# EAGLE design CardController (EAGLE 9.2.1)
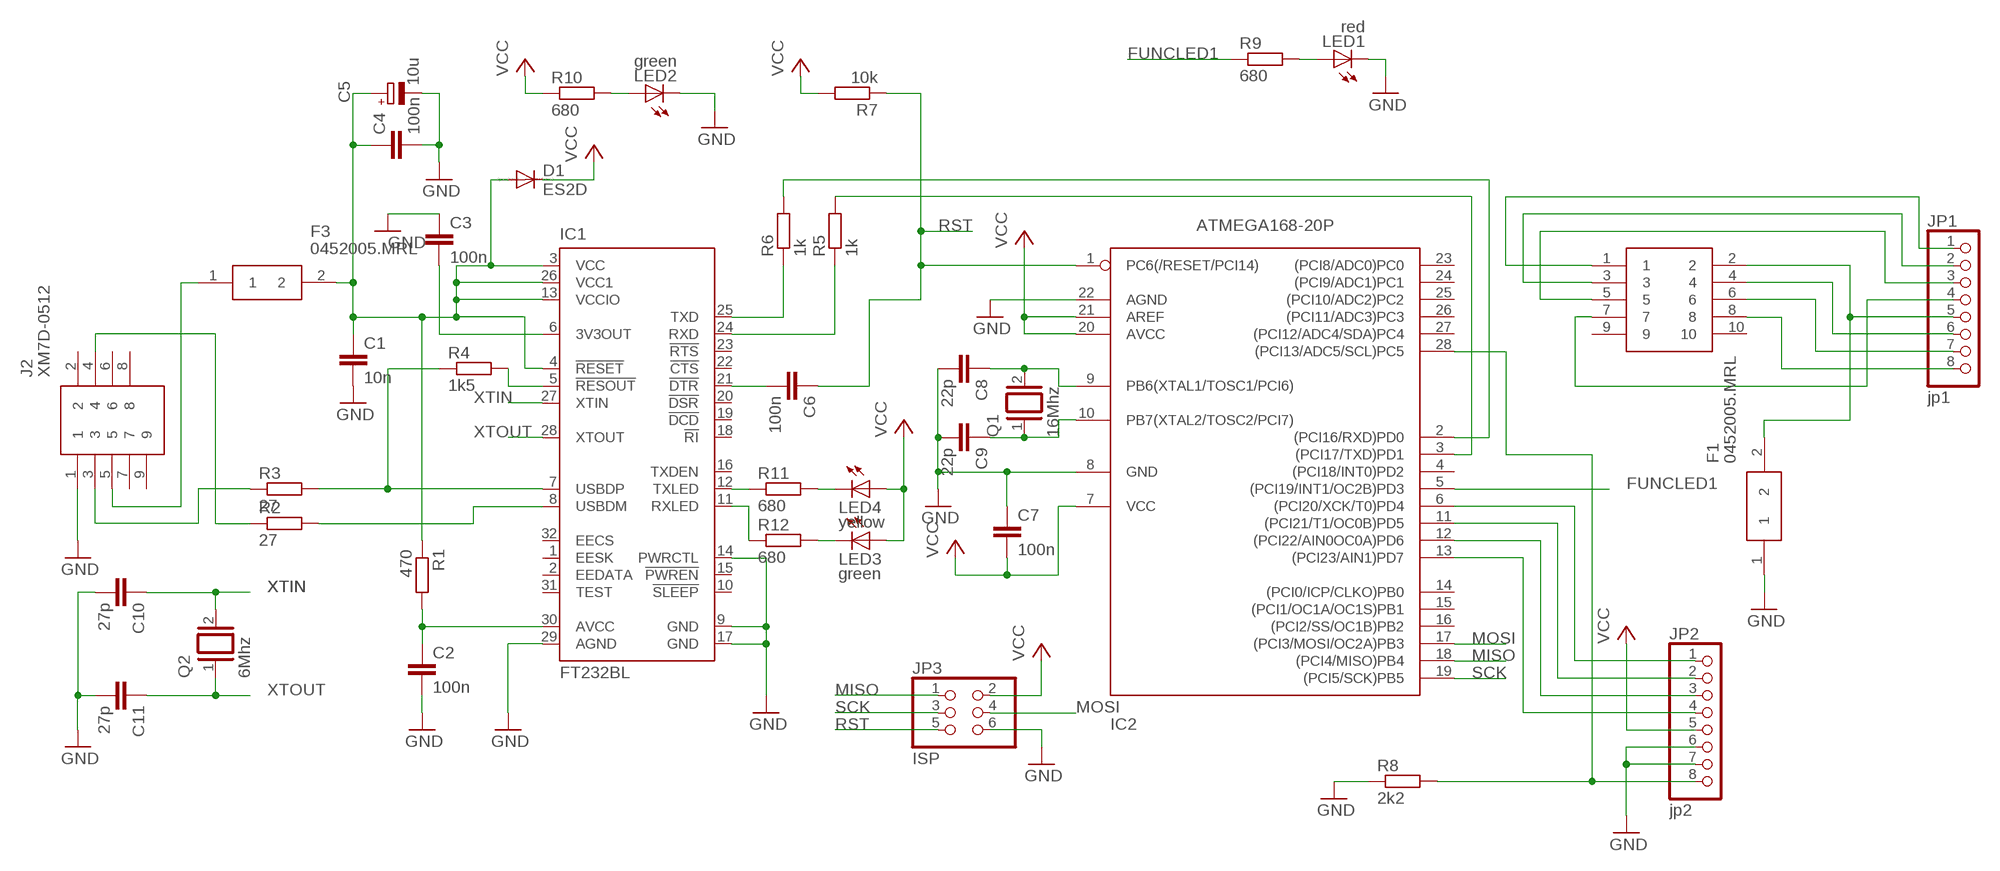
[diagram p0: schematic, sheet 1]

## Parts
C1  10n  C-EUC1206  [C1206]
C2  100n  C-EUC1206  [C1206]
C3  100n  C-EUC1206  [C1206]
C4  100n  C-EUC1206  [C1206]
C5  10u  CPOL-EUB/3528-21W  [B/3528-21W]
C6  100n  C-EUC1206  [C1206]
C7  100n  C-EUC1206  [C1206]
C8  22p  C-EUC1206  [C1206]
C9  22p  C-EUC1206  [C1206]
C10  27p  C-EUC1206  [C1206]
C11  27p  C-EUC1206  [C1206]
D1  ES2D  [SMB]
F1  0452005.MRL  [FUSC6127X294N]
F3  0452005.MRL  [FUSC6127X294N]
IC1  FT232BL  [LQFP32-7X7]
IC2  ATMEGA168-20P  [DIL28-3]
J1  615008140121  [615008140121]
J2  XM7D-0512  [XM7D0512]
JP1  jp1  PINHD-1X8  [1X08]
JP2  jp2  PINHD-1X8  [1X08]
JP3  ISP  PINHD-2X3  [2X03]
LED1  red  LEDSML1206  [SML1206]
LED2  green  LEDSML1206  [SML1206]
LED3  green  LEDSML1206  [SML1206]
LED4  yellow  LEDSML1206  [SML1206]
Q1  16Mhz  XTAL/S  [QS]
Q2  6Mhz  XTAL/S  [QS]
R1  470  R-EU_R0805  [R0805]
R2  27  R-EU_R0805  [R0805]
R3  27  R-EU_R0805  [R0805]
R4  1k5  R-EU_R0805  [R0805]
R5  1k  R-EU_R0805  [R0805]
R6  1k  R-EU_R0805  [R0805]
R7  10k  R-EU_R0805  [R0805]
R8  2k2  R-EU_R0805  [R0805]
R9  680  R-EU_R0805  [R0805]
R10  680  R-EU_R0805  [R0805]
R11  680  R-EU_R0805  [R0805]
R12  680  R-EU_R0805  [R0805]

## Nets
FUNCLED1: IC2.5((PCI19/INT1/OC2B)PD3) R9.1
GND: C1.2 C2.2 C3.1 C4.2 C5.- C7.1 C8.2 C9.2 C10.2 C11.2 F1.1 IC1.9(GND) IC1.14(PWRCTL) IC1.17(GND) IC1.29(AGND) IC2.8(GND) IC2.22(AGND) J2.1 JP2.6 JP2.7 JP3.6 LED1.C LED2.C R8.1
MISO: IC2.18((PCI4/MISO)PB4) JP3.1
MOSI: IC2.17((PCI3/MOSI/OC2A)PB3) JP3.4
N$1: F3.1 J2.5
N$2: C1.1 C4.1 C5.+ D1.A F3.2 IC1.3(VCC) IC1.4(!RESET) IC1.13(VCCIO) IC1.26(VCC1) R1.1
N$3: C2.1 IC1.30(AVCC) R1.2
N$4: C3.2 IC1.6(3V3OUT)
N$5: J2.4 R2.1
N$7: IC1.8(USBDM) R2.2
N$8: J1.3 JP1.2
N$9: IC1.5(!RESOUT) R4.2
N$10: IC1.25(TXD) R6.1
N$11: IC2.2((PCI16/RXD)PD0) R6.2
N$12: IC2.13((PCI23/AIN1)PD7) JP2.4
N$13: IC1.24(RXD) R5.1
N$14: C6.2 IC1.21(!DTR)
N$15: IC2.12((PCI22/AIN0OC0A)PD6) JP2.3
N$16: C8.1 IC2.9(PB6(XTAL1/TOSC1/PCI6)) Q1.2
N$17: C9.1 IC2.10(PB7(XTAL2/TOSC2/PCI7)) Q1.1
N$18: IC2.28((PCI13/ADC5/SCL)PC5) JP2.8 R8.2
N$19: IC1.12(TXLED) R11.1
N$20: LED1.A R9.2
N$21: J1.1 JP1.1
N$22: IC2.3((PCI17/TXD)PD1) R5.2
N$23: IC2.11((PCI21/T1/OC0B)PD5) JP2.2
N$24: IC2.6((PCI20/XCK/T0)PD4) JP2.1
N$25: J1.5 JP1.3
N$26: J1.7 JP1.4
N$27: F1.2 J1.2 JP1.5
N$28: J1.4 JP1.6
N$29: J1.6 JP1.7
N$31: J1.8 JP1.8
N$32: J2.3 R3.1
N$33: LED2.A R10.2
N$34: IC1.11(RXLED) R12.1
N$36: LED4.C R11.2
N$37: LED3.C R12.2
N$40: IC1.7(USBDP) R3.2 R4.1
RST: C6.1 IC2.1(PC6(/RESET/PCI14)) JP3.5 R7.1
SCK: IC2.19((PCI5/SCK)PB5) JP3.3
VCC: C7.2 D1.C IC2.7(VCC) IC2.20(AVCC) IC2.21(AREF) JP2.5 JP3.2 LED3.A LED4.A R7.2 R10.1
XTIN: C10.1 IC1.27(XTIN) Q2.2
XTOUT: C11.1 IC1.28(XTOUT) Q2.1
Unconnected: IC1.1(EESK) IC1.2(EEDATA) IC1.10(!SLEEP) IC1.15(!PWREN) IC1.16(TXDEN) IC1.18(!RI) IC1.19(!DCD) IC1.20(!DSR) IC1.22(!CTS) IC1.23(!RTS) IC1.31(TEST) IC1.32(EECS) IC2.4((PCI18/INT0)PD2) IC2.14((PCI0/ICP/CLKO)PB0) IC2.15((PCI1/OC1A/OC1S)PB1) IC2.16((PCI2/SS/OC1B)PB2) IC2.23((PCI8/ADC0)PC0) IC2.24((PCI9/ADC1)PC1) IC2.25((PCI10/ADC2)PC2) IC2.26((PCI11/ADC3)PC3) IC2.27((PCI12/ADC4/SDA)PC4) J1.9 J1.10 J2.2 J2.6 J2.7 J2.8 J2.9

## Library data of the parts
C1-C4 C6-C11 = rcl:C-EU: CAPACITOR, European symbol; SPICEPREFIX: C
C5 = rcl:CPOL-EU: POLARIZED CAPACITOR, European symbol; SPICEPREFIX: C
D1 = diode:ES2D: DIODE super fast rectifier, 2 A
F1 F3 = SamacSys_Parts:0452005.MRL: Fuse,Nano2,min,452,5A Source: Datasheet <https://componentsearchengine.com/Datasheets/1/0452005.MRL.pdf>; DESCRIPTION: Fuse,Nano2,min,452,5A; HEIGHT: 2.94mm; MANUFACTURER_NAME: LITTELFUSE; MANUFACTURER_PART_NUMBER: 0452005.MRL; MOUSER_PART_NUMBER: 576-0452005.MRL
IC1 = ftdichip:FT232B: USB to serial UART interface Source: DS_FT232BL_BQ.pdf; MF: FARNELL; MPN: FT232BL/TR; OC_FARNELL: unknown; OC_NEWARK: 38K1551
IC2 = adafruit:ATMEGA168*P: MICROCONTROLLER 16 kBytes FLASH 1 kBytes SRAM 512 Bytes EEPROM USART 8-channel 10 bit ADC
J1 = SamacSys_Parts:615008140121: Wurth Elektronik WR-MJ, 615008 Series Series Number Cat5 8 Way Horizontal PCB Mount STP RJ45 Modular Jack, Socket Source: Datasheet <https://componentsearchengine.com/Datasheets/1/615008140121.pdf>; DESCRIPTION: Wurth Elektronik WR-MJ, 615008 Series Series Number Cat5 8 Way Horizontal PCB Mount STP RJ45 Modular Jack, Socket; HEIGHT: 12mm; MANUFACTURER_NAME: Wurth Elektronik; MANUFACTURER_PART_NUMBER: 615008140121; MOUSER_PART_NUMBER: 710-615008140121
J2 = SamacSys_Parts:XM7D-0512: OMRON ELECTRONIC COMPONENTS - XM7D-0512 - MINI USB, 2.0 TYPE B, RECEPTACLE, TH Source: Datasheet <https://componentsearchengine.com/Datasheets/1/XM7D-0512.pdf>; DESCRIPTION: OMRON ELECTRONIC COMPONENTS - XM7D-0512 - MINI USB, 2.0 TYPE B, RECEPTACLE, TH; HEIGHT: 3mm; MANUFACTURER_NAME: Omron Electronics; MANUFACTURER_PART_NUMBER: XM7D-0512; MOUSER_PART_NUMBER: 653-XM7D-0512
JP1 JP2 = pinhead:PINHD-1X8: PIN HEADER
JP3 = pinhead:PINHD-2X3: PIN HEADER
LED1-LED4 = led:LED: LED OSRAM: - CHIPLED LG R971, LG N971, LY N971, LG Q971, LY Q971, LO R971, LY R971 LH N974, LH R974 LS Q976, LO Q976, LY Q976 LO Q996 - Hyper CHIPLED LW Q18S LB Q993, LB Q99A, LB R99A - SideLED LS A670, LO A670, LY A670, LG A670, LP A670 LB A673, LV A673, LT A673, LW A673 LH A674 LY A675 LS A676, LA A676, LO A676, LY A676, LW A676 LS A679, LY A679, LG A679 - Hyper Micro SIDELED® LS Y876, LA Y876, LO Y876, LY Y876 LT Y87S - SmartLED LW L88C, LW L88S LB L89C, LB L89S, LG L890 LS L89K, LO L89K, LY L89K LS L896, LA L896, LO L896, LY L896 - TOPLED LS T670, LO T670, LY T670, LG T670, LP T670 LSG T670, LSP T670, LSY T670, LOP T670, LYG T670 LG T671, LOG T671, LSG T671 LB T673, LV T673, LT T673, LW T673 LH T674 LS T676, LA T676, LO T676, LY T676, LB T676, LH T676, LSB T676, LW T676 LB T67C, LV T67C, LT T67C, LS T67K, LO T67K, LY T67K, LW E67C LS E67B, LA E67B, LO E67B, LY E67B, LB E67C, LV E67C, LT E67C LW T67C LS T679, LY T679, LG T679 LS T770, LO T770, LY T770, LG T770, LP T770 LB T773, LV T773, LT T773, LW T773 LH T774 LS E675, LA E675, LY E675, LS T675 LS T776, LA T776, LO T776, LY T776, LB T776 LHGB T686 LT T68C, LB T68C - Hyper Mini TOPLED® LB M676 - Mini TOPLED Santana® LG M470 LS M47K, LO M47K, LY M47K Source: http://www.osram.convergy.de LUXEON: - LUMILED® LXK2-PW12-R00, LXK2-PW12-S00, LXK2-PW14-U00, LXK2-PW14-V00 LXK2-PM12-R00, LXK2-PM12-S00, LXK2-PM14-U00 LXK2-PE12-Q00, LXK2-PE12-R00, LXK2-PE12-S00, LXK2-PE14-T00, LXK2-PE14-U00 LXK2-PB12-K00, LXK2-PB12-L00, LXK2-PB12-M00, LXK2-PB14-N00, LXK2-PB14-P00, LXK2-PB14-Q00 LXK2-PR12-L00, LXK2-PR12-M00, LXK2-PR14-Q00, LXK2-PR14-R00 LXK2-PD12-Q00, LXK2-PD12-R00, LXK2-PD12-S00 LXK2-PH12-R00, LXK2-PH12-S00 LXK2-PL12-P00, LXK2-PL12-Q00, LXK2-PL12-R00 Source: www.luxeon.com KINGBRIGHT: KA-3528ASYC Source: www.kingbright.com
Q1 Q2 = special:XTAL/S: CRYSTAL
R1-R12 = rcl:R-EU_: RESISTOR, European symbol; SPICEPREFIX: R

## Board
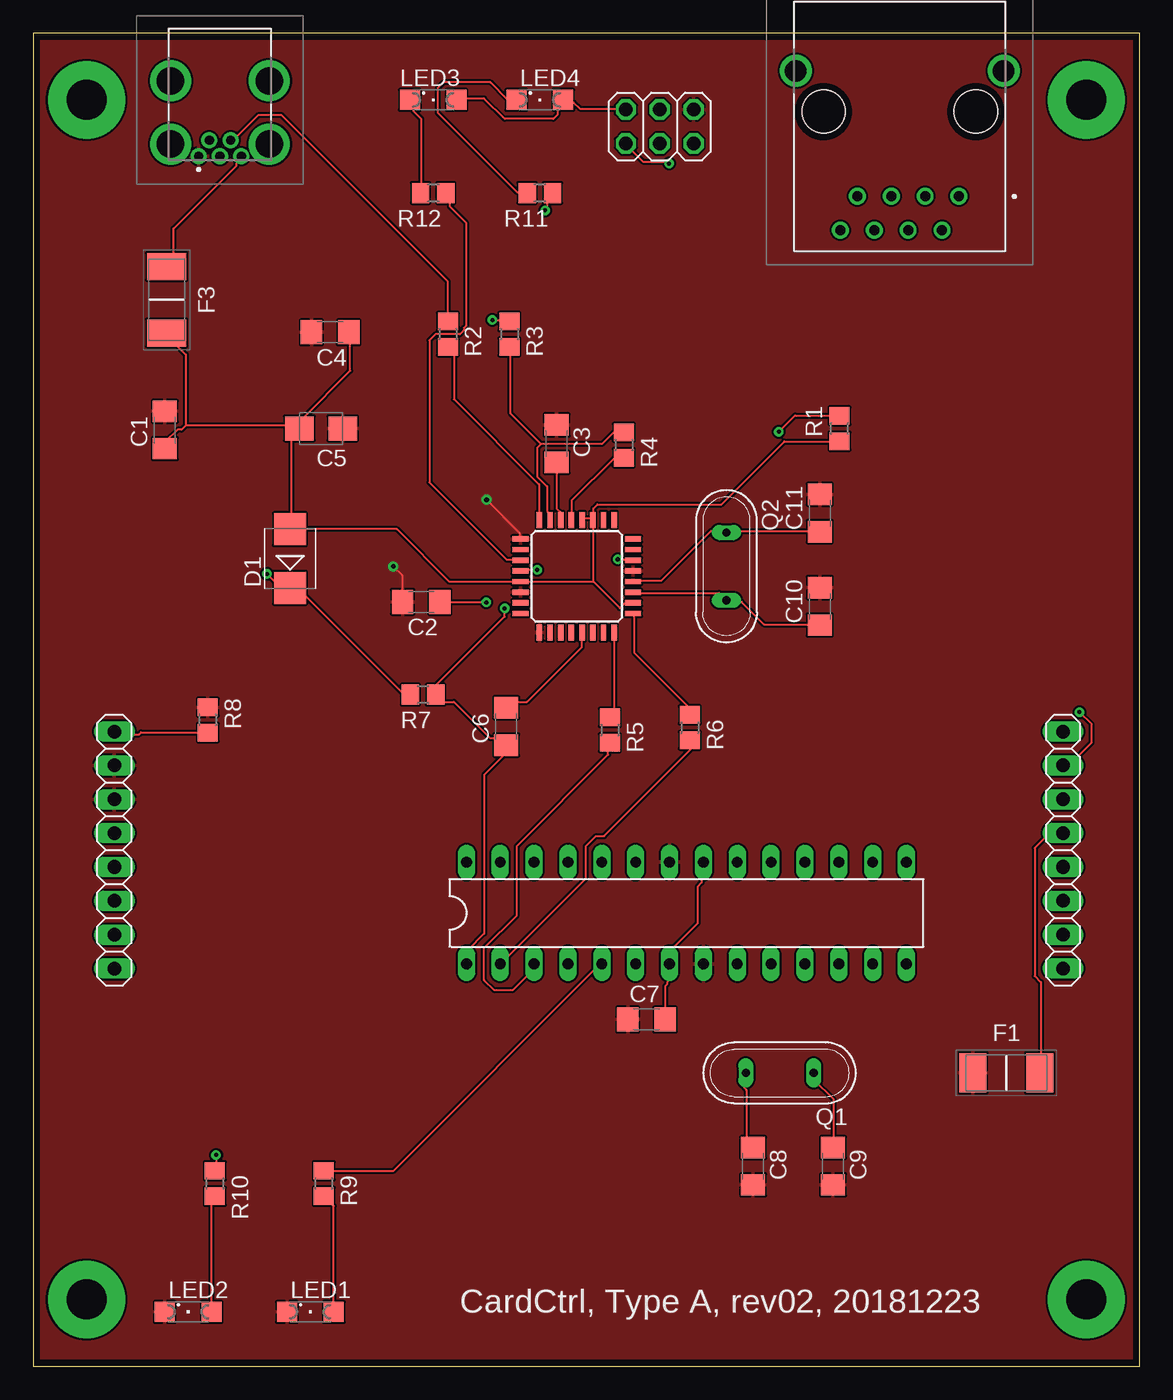
[diagram p1: board, top side]
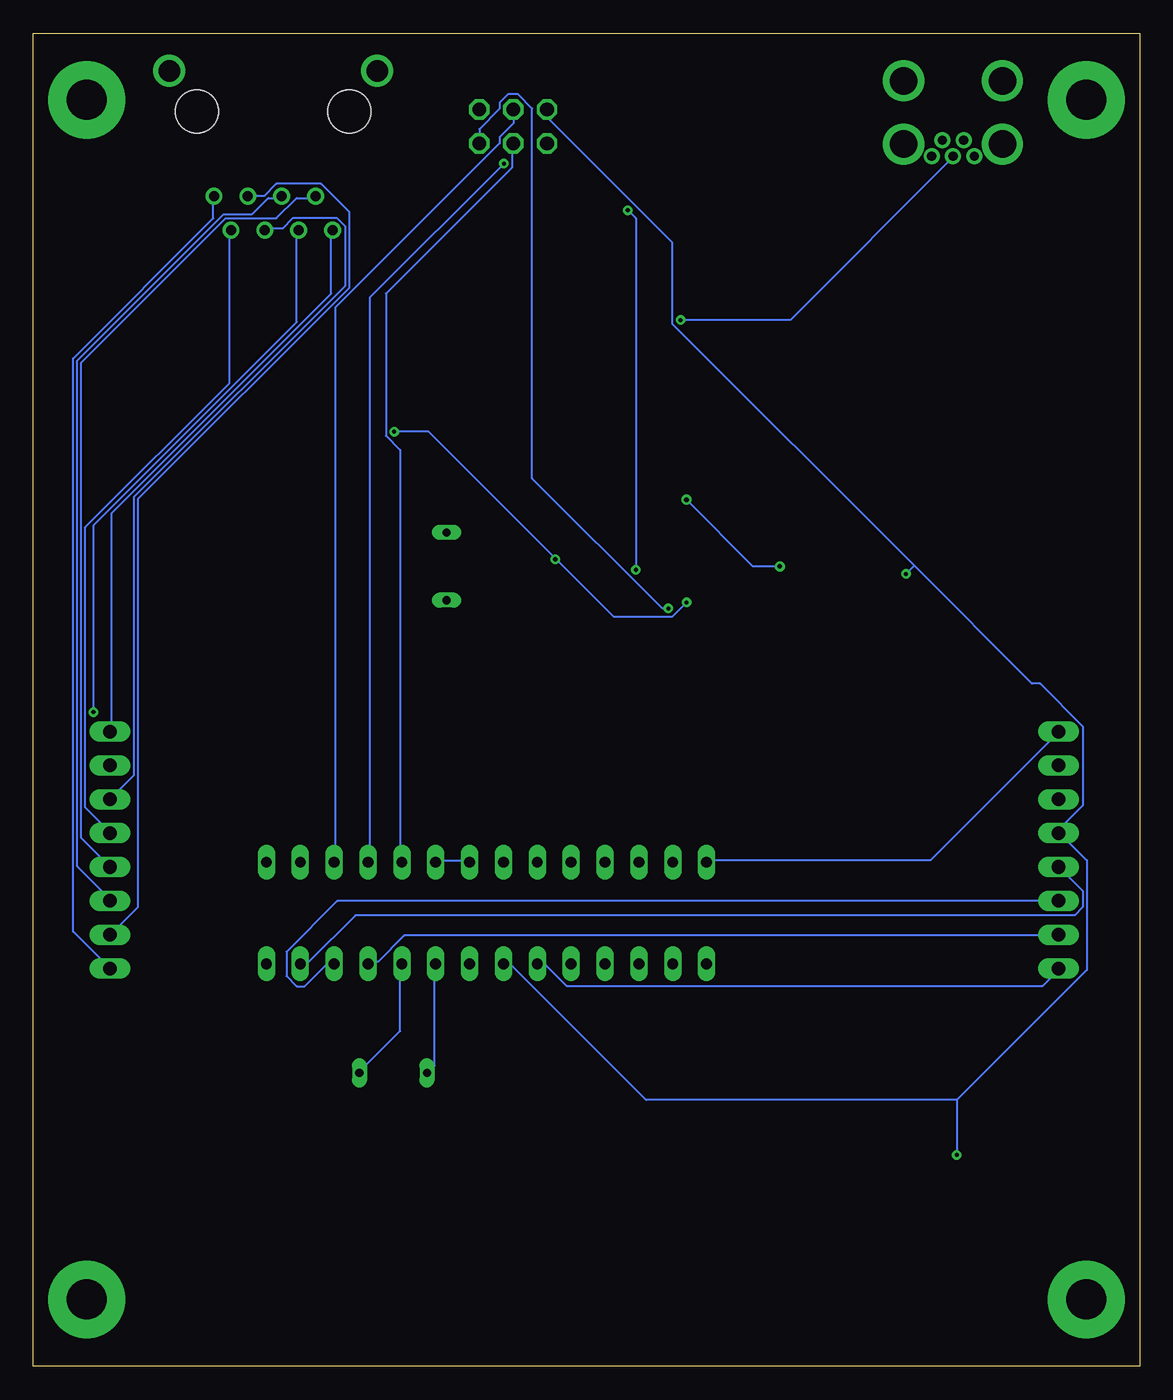
[diagram p2: board, bottom side, seen from below]

Size 83 x 99.99 mm. Coordinates in mm from the lower left corner, seen from the top.
Outline: 0,0 83,0 83,99.99 0,99.99 0,0
Copper layers (1*16): Top 0.035mm / dielectric 1.5mm / Bottom 0.035mm
Design rules "NYAKARUHAZ_StandardNYAK": minimum track width 6mil, minimum drill 12mil, track to track 6mil, track to pad 6mil, pad to pad 6mil, via to via 6mil, smd to smd 6mil, copper to edge 20mil, drill to drill 8mil, minimum pad ring 10mil, minimum via ring 8mil, stop-mask expansion 4mil, vias tented up to drill 0mil, thermal gap 6mil

### Footprints (pad centres in the part's own frame; a part is rotated, then mirrored left to right if it is on the bottom)
C1206 = smd 1.6 x 1.8: 1 -1.4,0; 2 1.4,0
B/3528-21W = smd 2.15 x 1.8: + 1.625,0; - -1.625,0
SMB = smd 2.4 x 2.4: A 2.2,0; C -2.2,0
FUSC6127X294N = smd 2.02 x 2.95: 1 -2.5,0; 2 2.5,0
LQFP32-7X7 = smd 1.2 x 0.4: 1 -4.225,2.8; 2 -4.225,2; 3 -4.225,1.2; 4 -4.225,0.4; 5 -4.225,-0.4; 6 -4.225,-1.2; 7 -4.225,-2; 8 -4.225,-2.8; 17 4.225,-2.8; 18 4.225,-2; 19 4.225,-1.2; 20 4.225,-0.4; 21 4.225,0.4; 22 4.225,1.2; 23 4.225,2; 24 4.225,2.8 | smd 0.4 x 1.2: 9 -2.8,-4.225; 10 -2,-4.225; 11 -1.2,-4.225; 12 -0.4,-4.225; 13 0.4,-4.225; 14 1.2,-4.225; 15 2,-4.225; 16 2.8,-4.225; 25 2.8,4.225; 26 2,4.225; 27 1.2,4.225; 28 0.4,4.225; 29 -0.4,4.225; 30 -1.2,4.225; 31 -2,4.225; 32 -2.8,4.225
DIL28-3 = drill 0.813 long: 1 -16.51,-3.81; 2 -13.97,-3.81; 3 -11.43,-3.81; 4 -8.89,-3.81; 5 -6.35,-3.81; 6 -3.81,-3.81; 7 -1.27,-3.81; 8 1.27,-3.81; 9 3.81,-3.81; 10 6.35,-3.81; 11 8.89,-3.81; 12 11.43,-3.81; 13 13.97,-3.81; 14 16.51,-3.81; 15 16.51,3.81; 16 13.97,3.81; 17 11.43,3.81; 18 8.89,3.81; 19 6.35,3.81; 20 3.81,3.81; 21 1.27,3.81; 22 -1.27,3.81; 23 -3.81,3.81; 24 -6.35,3.81; 25 -8.89,3.81; 26 -11.43,3.81; 27 -13.97,3.81; 28 -16.51,3.81
615008140121 = drill 0.75 pad 1.2: 1 -4.445,5.23; 2 -3.175,7.77; 3 -1.905,5.23; 4 -0.635,7.77; 5 0.635,5.23; 6 1.905,7.77; 7 3.175,5.23; 8 4.445,7.77 | drill 1.6 pad 2.4: 9 -7.8,-4.17; 10 7.8,-4.17 | hole 3.25: -5.715,-1.12; 5.715,-1.12
XM7D0512 = drill 0.7 pad 1.2: 1 -1.6,-4.225; 2 -0.8,-3.025; 3 0,-4.225; 4 0.8,-3.025; 5 1.6,-4.225 | drill 2.062 pad 3.092: 6 -3.7,-3.325; 7 3.7,-3.325; 8 -3.7,1.425; 9 3.7,1.425
1X08 = drill 1.016 long: 1 -8.89,0; 2 -6.35,0; 3 -3.81,0; 4 -1.27,0; 5 1.27,0; 6 3.81,0; 7 6.35,0; 8 8.89,0
2X03 = drill 1.016 octagon: 1 -2.54,-1.27; 2 -2.54,1.27; 3 0,-1.27; 4 0,1.27; 5 2.54,-1.27; 6 2.54,1.27
SML1206 = smd 1.5 x 1.5: A 1.75,0; C -1.75,0
QS = drill 0.61 long: 1 -2.54,0; 2 2.54,0
R0805 = smd 1.3 x 1.5: 1 -0.95,0; 2 0.95,0

### Placement (x,y rotation side)
C1  9.86,70.23 90 top
C2  29.1,57.34 180 top
C3  39.26,69.21 270 top
C4  22.26,77.56 180 top
C5  21.59,70.34 180 top
C6  35.48,47.99 90 top
C7  46,26 0 top
C8  54,15 270 top
C9  60,15 270 top
C10  59,57 90 top
C11  59,64 90 top
D1  19.26,60.59 90 top
F1  73,22 0 top
F3  10,80 270 top
IC1  40.77,59.26 270 top
IC2  49,34 0 top
J1  65,93 180 top
J2  14,95 0 top
JP1  77.25,38.72 90 top
JP2  6.08,38.72 90 top
JP3  47,93 0 top
LED1  20.78,4.08 0 top
LED2  11.62,4.08 0 top
LED3  30,95 0 top
LED4  38,95 0 top
Q1  56,22 180 top
Q2  52,60 270 top
R1  60.48,70.34 90 top
R2  31.1,77.42 270 top
R3  35.72,77.42 270 top
R4  44.31,69.1 270 top
R5  43.26,47.72 270 top
R6  49.26,47.91 270 top
R7  29.24,50.37 180 top
R8  13.08,48.48 270 top
R9  21.78,13.7 270 top
R10  13.62,13.7 270 top
R11  38,88 180 top
R12  30,88 180 top

### Tracks (layer width: path | path; a pad name or v marks a point on that pad's centre or on a via)
FUNCLED1
  Top 0.152: IC2.5 42.52,30.18 26.98,14.63 21.79,14.63 R9.1
GND  (via drill 0.35)
  Top 0.152: 36.48,62 IC1.9 arc-90 36.48,62 | C2.2 27.7,59.3 v27,60 | v34,65 36.48,62.52 36.48,62
  Bottom 0.152: v27,60 29,60 v34,65
  pour Top: -1.27,102.28 84.79,102.28 84.79,-1.27 -2.54,-1.27 -1.27,0
MISO  (via drill 0.3)
  Top 0.152: v47.7,90.22 47.55,90.37 45.72,90.37 44.5,91.59 JP3.1
  Bottom 0.152: v47.7,90.22 57.76,80.16 57.76,37.95 IC2.18
MOSI
  Bottom 0.152: JP3.4 46.94,94.18 46.94,93.27 48.01,92.2 48.01,91.75 60.35,79.4 60.35,37.95 IC2.17
N$1
  Top 0.152: 10.82,83.21 10.06,82.45 F3.1 10.82,83.21 | 10.82,83.21 10.52,83.52 10.52,85.34 15.24,90.07 15.24,90.22 15.54,90.53 15.54,90.68 J2.5
N$2
  Top 0.152: 44.45,57.33 44.91,57.33 IC1.26 44.45,57.33 | 44.45,57.33 44,56.87 42.01,58.86 | IC1.3 42.01,63.43 42.01,58.87 42.01,58.86 | IC1.3 41.86,63.58 41.3,63.58 41.3,63.55 IC1.4 | R1.1 60.45,69.37 56.34,69.37 51.62,64.64 42.32,64.64 42.01,64.34 42.01,63.58 IC1.3 | 42.01,58.86 IC1.13 36.42,58.83 31.24,58.83 27.28,62.79 19.36,62.79 D1.A 19.36,62.94 19.36,69.65 19.66,69.95 | C4.1 23.77,77.42 23.77,74.68 20.12,71.02 20.12,70.41 C5.+ | 19.66,69.95 19.96,70.26 C5.+ | 19.66,69.95 19.2,70.41 | 19.66,69.95 C5.+ | 11.43,70.56 11.12,70.26 10.82,70.26 9.91,69.34 9.91,68.89 C1.1 | 11.43,70.56 11.43,75.89 9.91,77.42 F3.2 | 11.43,70.56 18.9,70.56 19.05,70.41 19.2,70.41 | 19.2,70.41 C5.+
N$3  (via drill 0.3)
  Top 0.152: v33.98,57.3 30.63,57.3 C2.1 | v55.93,70.1 57.15,71.32 60.35,71.32 R1.2 | IC1.30 43.91,60.46 v43.84,60.53
  Bottom 0.152: v33.98,57.3 35.05,56.24 39.47,56.24 43.74,60.5 v43.84,60.53 43.89,60.66 53.34,70.1 v55.93,70.1
N$4
  Top 0.152: IC1.6 39.62,63.55 39.62,64.01 39.26,64.35 C3.2
N$5
  Top 0.152: R2.1 31.09,78.49 31.09,81.38 18.59,93.88 16.92,93.88 14.94,91.9 J2.4
N$6  (via drill 3 pad 5.8)
  other vias: 4,95
N$7
  Top 0.152: 31.39,76.2 31.24,76.35 R2.2 31.39,76.2 | 31.39,76.2 31.39,76.05 31.55,75.89 31.55,72.54 37.95,66.14 37.95,63.55 IC1.8
N$8
  Bottom 0.152: J1.3 66.9,87.78 65.68,87.78 64.77,88.7 61.42,88.7 59.28,86.56 59.28,80.92 75.13,65.08 75.13,34.44 77.11,32.46 JP1.2
N$9
  Top 0.152: IC1.5 40.34,63.43 40.34,63.12 IC1.5 | IC1.5 40.39,63.55 40.39,64.92 43.59,68.12 44.2,68.12 R4.2
N$10
  Top 0.152: R6.1 49.23,48.92 49.23,49.38 45.11,53.49 45.11,56.39 IC1.25
N$11
  Top 0.152: 49.68,46.63 49.38,46.94 R6.2 49.68,46.63 | 49.68,46.63 42.82,39.78 42.22,39.78 41.45,39.01 41.45,36.58 35.05,30.18 IC2.2
N$12
  Bottom 0.152: IC2.13 62.94,30.33 62.33,30.33 58.83,33.83 4.88,33.83 4.27,34.44 4.27,35.66 5.94,37.34 JP2.4
N$13
  Top 0.152: IC1.24 43.59,55.02 43.59,49.07 43.28,48.77 R5.1
N$14
  Top 0.152: IC1.21 41.15,55.02 41.15,53.95 37.03,49.84 36.27,49.84 35.97,49.53 35.51,49.53 C6.2
N$15
  Bottom 0.152: IC2.12 60.5,30.18 60.96,30.18 62.64,28.5 63.25,28.5 64.01,29.26 64.01,31.09 60.2,34.9 6.1,34.9 JP2.3
N$16
  Top 0.152: C8.1 54.1,16.46 53.49,17.07 C8.1 | Q1.2 53.34,21.95 53.34,20.88 53.49,20.73 53.49,16.91 C8.1
  Bottom 0.152: IC2.9 52.88,30.18 52.88,22.55 53.34,22.1 Q1.2
N$17
  Top 0.152: C9.1 60.05,16.46 60.05,20 58.54,21.51 Q1.1
  Bottom 0.152: IC2.10 55.47,30.18 55.47,25.15 58.52,22.1 Q1.1
N$18
  Top 0.152: R8.2 12.95,47.55 8.08,47.55 7.92,47.4 6.25,47.4 6.1,47.55 JP2.8
  Bottom 0.152: IC2.28 32.46,37.95 15.7,37.95 6.1,47.55 JP2.8
N$19  (via drill 0.3)
  Top 0.152: v37.8,59.74 36.58,59.74 IC1.12 | 39.01,87.78 39.01,87.94 R11.1 39.01,87.78 | v38.41,86.72 38.56,86.87 38.56,87.33 39.01,87.78
  Bottom 0.152: v37.8,59.74 37.8,86.11 v38.41,86.72
N$20
  Top 0.152: LED1.A 22.53,12 R9.2
N$21
  Bottom 0.152: J1.1 69.49,87.63 69.49,86.11 80.01,75.59 80.01,32.61 77.27,29.87 JP1.1
N$22
  Top 0.152: R5.2 43.13,46.63 43.13,45.87 36.27,39.01 36.27,33.83 33.83,31.39 33.83,28.96 34.59,28.19 35.97,28.19 37.49,29.72 37.49,30.18 IC2.3
N$23
  Bottom 0.152: IC2.11 57.76,30.33 57.15,30.33 55.17,32.31 6.1,32.31 JP2.2
N$24
  Bottom 0.152: IC2.6 45.11,30.18 44.65,30.18 42.98,28.5 7.32,28.5 6.1,29.72 JP2.1
N$25
  Bottom 0.152: J1.5 64.47,87.63 65.38,87.63 66.6,86.41 68.73,86.41 79.7,75.44 79.7,37.49 77.27,35.05 JP1.3
N$26
  Bottom 0.152: J1.7 61.87,87.63 63.25,87.63 64.77,86.11 68.58,86.11 79.4,75.29 79.4,39.62 77.27,37.49 JP1.4
N$27
  Top 0.152: F1.2 75.59,22.1 75.59,28.8 75.13,29.26 75.13,38.86 76.2,39.93 77.11,39.93 JP1.5
  Bottom 0.152: J1.2 68.28,85.19 68.28,73.76 79.1,62.94 79.1,41.91 77.27,40.08 JP1.5
N$28
  Bottom 0.152: J1.4 65.53,85.34 64.31,85.34 63.55,86.11 60.2,86.11 59.59,85.5 59.59,81.08 75.44,65.23 75.44,44.35 77.11,42.67 JP1.6
N$29  (via drill 0.3)
  Top 0.152: v78.49,49.07 79.4,48.16 79.4,46.79 77.72,45.11 77.27,45.11 JP1.7
  Bottom 0.152: v78.49,49.07 78.49,63.09 63.25,78.33 63.25,85.19 J1.6
N$31
  Bottom 0.152: J1.8 60.66,85.19 60.66,80.47 77.11,64.01 77.11,47.7 JP1.8
N$32  (via drill 0.3)
  Top 0.152: v34.44,78.49 35.66,78.49 R3.1
  Bottom 0.152: v34.44,78.49 26.21,78.49 14.02,90.68 J2.3
N$33
  Top 0.152: LED2.A 13.37,12.5 R10.2
N$34
  Top 0.152: 31.24,87.94 31.09,87.94 R12.1 31.24,87.94 | 31.24,87.94 31.24,87.02 32.46,85.8 32.46,78.03 32.31,77.88 32.31,77.72 32,77.42 30.18,77.42 29.72,76.96 29.72,66.29 35.51,60.5 36.42,60.5 IC1.11
N$35  (via drill 3 pad 5.8)
  other vias: 79,95
N$36
  Top 0.152: R11.2 37.03,88.09 36.27,88.09 30.33,94.03 30.33,95.86 30.79,96.32 34.29,96.32 35.51,95.1 36.12,95.1 LED4.C
N$37
  Top 0.152: LED3.C 28.35,94.94 28.35,94.49 28.5,94.34 28.5,94.18 29.11,93.57 29.11,88.09 R12.2
N$38  (via drill 3 pad 5.8)
  other vias: 79,5
N$39  (via drill 3 pad 5.8)
  other vias: 4,5
N$40
  Top 0.152: 38.1,69.19 37.8,68.89 37.8,66.75 38.56,65.99 38.56,64.16 38.71,64.01 38.71,63.55 IC1.7 | 38.1,69.19 42.67,69.19 43.59,70.1 44.2,70.1 R4.1 | 38.1,69.19 35.81,71.48 35.81,76.35 R3.2
RST  (via drill 0.3)
  Top 0.152: IC2.1 32.61,30.33 32.61,31.24 33.83,32.46 33.83,44.35 35.36,45.87 35.36,46.48 C6.1 35.36,46.63 34.9,47.09 34.29,47.09 31.55,49.84 30.18,49.84 30.19,49.85 R7.1 30.18,50.44 30.18,51.05 35.36,56.24 v35.36,56.84
  Bottom 0.152: JP3.5 49.53,91.75 49.53,92.81 48.01,94.34 48.01,94.79 47.4,95.4 46.63,95.4 45.57,94.34 45.57,66.6 35.81,56.84 v35.36,56.84
SCK
  Bottom 0.152: IC2.19 55.47,37.95 55.47,68.73 56.54,69.8 56.54,80.47 47.09,89.92 47.09,91.59 JP3.3
VCC  (via drill 0.3)
  Top 0.152: 39.32,94.94 39.62,94.94 LED4.A | 40.23,94.94 39.78,94.94 LED4.A | 40.23,94.94 40.39,94.79 40.54,94.79 41,94.34 44.35,94.34 JP3.2 | 40.23,94.94 LED4.A | v13.72,15.85 13.72,14.78 R10.1 | C7.2 47.4,26.06 47.4,28.5 47.55,28.65 47.55,28.8 47.7,28.96 47.7,30.18 IC2.7 47.85,30.33 47.85,31.24 49.84,33.22 49.84,35.97 50.14,36.27 50.14,37.8 IC2.21 | 27.74,50.44 28.19,50.44 R7.2 27.74,50.44 | 19.81,58.37 19.36,58.37 D1.C | 19.81,58.37 27.74,50.44 | 19.81,58.37 D1.C | 39.32,94.94 39.32,93.88 39.01,93.57 35.36,93.57 33.83,95.1 31.85,95.1 LED3.A | 39.32,94.94 LED4.A | v17.53,59.44 18.44,58.52 19.2,58.52 D1.C
  Bottom 0.152: 44.35,93.57 44.35,94.18 44.37,94.18 JP3.2 44.35,93.57 | 13.72,19.96 v13.72,15.85 | 13.72,19.96 3.96,29.72 3.96,37.95 5.94,39.93 JP2.5 5.94,40.08 5.94,40.39 4.27,42.06 4.27,48.01 7.47,51.21 8.08,51.21 16.92,60.05 | IC2.21 50.29,37.95 52.73,37.95 IC2.20 | 44.35,93.57 35.05,84.28 35.05,78.18 16.92,60.05 | 16.92,60.05 v17.53,59.44 | 13.72,19.96 37.03,19.96 47.24,30.18 47.7,30.18 IC2.7
XTIN
  Top 0.152: C10.1 58.93,55.65 54.82,55.65 53.14,57.33 52.07,57.33 Q2.2 51.46,58 45.05,58 IC1.27
XTOUT
  Top 0.152: C11.1 58.93,62.66 52.12,62.66 Q2.1 50.98,62.54 50.85,62.66 47.09,58.91 45.04,58.91 IC1.28

### Text on the board
tNames: CardCtrl, Type A, rev02, 20181223